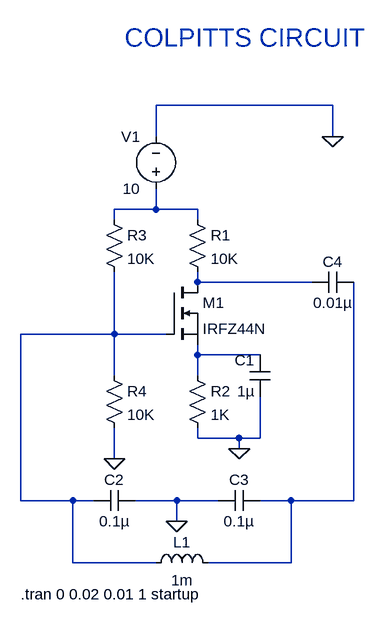
[diagram p0: schematic 14)Colpitts_circuit.asc]
14)Colpitts_circuit.asc, the LTspice schematic file:
Version 4
SHEET 1 1152 680
WIRE 432 -304 160 -304
WIRE 160 -256 160 -304
WIRE 432 -256 432 -304
WIRE 160 -144 160 -176
WIRE 160 -144 96 -144
WIRE 224 -144 160 -144
WIRE 96 -128 96 -144
WIRE 224 -128 224 -144
WIRE 224 -32 224 -48
WIRE 400 -32 224 -32
WIRE 96 48 96 -48
WIRE 96 48 -48 48
WIRE 176 48 96 48
WIRE 224 80 224 64
WIRE 320 80 224 80
WIRE 96 112 96 48
WIRE 224 112 224 80
WIRE 224 208 224 192
WIRE 288 208 224 208
WIRE 320 208 320 144
WIRE 320 208 288 208
WIRE 288 224 288 208
WIRE 96 240 96 192
WIRE -48 304 -48 48
WIRE 32 304 -48 304
WIRE 64 304 32 304
WIRE 192 304 128 304
WIRE 256 304 192 304
WIRE 368 304 320 304
WIRE 464 304 464 -32
WIRE 464 304 368 304
WIRE 192 336 192 304
WIRE 32 400 32 304
WIRE 160 400 32 400
WIRE 368 400 368 304
WIRE 368 400 240 400
FLAG 192 336 0
FLAG 288 224 0
FLAG 432 -256 0
FLAG 96 240 0
SYMBOL nmos 176 -32 R0
SYMATTR InstName M1
SYMATTR Value IRFZ44N
SYMBOL res 208 -144 R0
SYMATTR InstName R1
SYMATTR Value 10K
SYMBOL res 208 96 R0
SYMATTR InstName R2
SYMATTR Value 1K
SYMBOL res 80 -144 R0
SYMATTR InstName R3
SYMATTR Value 10K
SYMBOL res 80 96 R0
SYMATTR InstName R4
SYMATTR Value 10K
SYMBOL cap 128 288 R90
WINDOW 0 0 32 VBottom 2
WINDOW 3 32 32 VTop 2
SYMATTR InstName C2
SYMATTR Value 0.1µ
SYMBOL cap 320 288 R90
WINDOW 0 0 32 VBottom 2
WINDOW 3 32 32 VTop 2
SYMATTR InstName C3
SYMATTR Value 0.1µ
SYMBOL ind 144 416 R270
WINDOW 0 32 56 VTop 2
WINDOW 3 5 56 VBottom 2
SYMATTR InstName L1
SYMATTR Value 1m
SYMBOL voltage 160 -160 R180
WINDOW 0 24 96 Left 2
WINDOW 3 24 16 Left 2
WINDOW 123 0 0 Left 0
WINDOW 39 0 0 Left 0
SYMATTR InstName V1
SYMATTR Value 10
SYMBOL cap 336 144 R180
WINDOW 0 24 56 Left 2
WINDOW 3 24 8 Left 2
SYMATTR InstName C1
SYMATTR Value 1µ
SYMBOL cap 464 -48 R90
WINDOW 0 0 32 VBottom 2
WINDOW 3 32 32 VTop 2
SYMATTR InstName C4
SYMATTR Value 0.01µ
TEXT -48 448 Left 2 !.tran 0 0.02 0.01 1 startup
TEXT 112 -408 Left 4 ;COLPITTS CIRCUIT

The netlist it stands for:
* 14)Colpitts_circuit.asc
M1 N002 N003 N004 N004 IRFZ44N
R1 N001 N002 10K
R2 N004 0 1K
R3 N001 N003 10K
R4 N003 0 10K
C2 0 N003 0.1µ
C3 N005 0 0.1µ
L1 N003 N005 1m
V1 N001 0 10
C1 0 N004 1µ
C4 N005 N002 0.01µ
.model NMOS NMOS
.model PMOS PMOS
.lib standard.mos
.tran 0 0.02 0.01 1 startup
* COLPITTS CIRCUIT
.backanno
.end